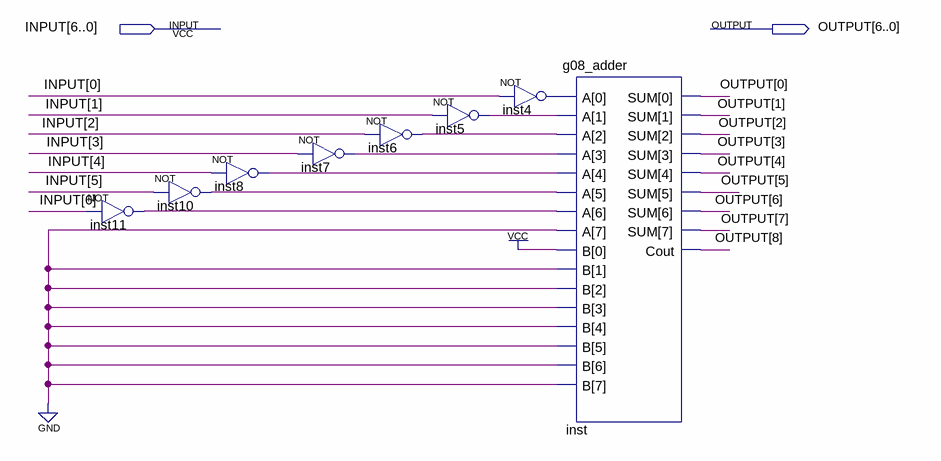
[diagram p0: schematic sheet]
// Quartus schematic 2C7BITS.bdf as structural Verilog: 8 symbols, 2 pins
module \2C7BITS  (
  input  [6:0] INPUT,
  output [8:0] OUTPUT
);

  wire inst4_out, inst5_out, inst6_out, inst7_out, inst8_out, inst10_out, inst11_out;

  not inst11 (inst11_out, INPUT[6]);
  not inst8 (inst8_out, INPUT[4]);
  not inst10 (inst10_out, INPUT[5]);
  not inst7 (inst7_out, INPUT[3]);
  not inst6 (inst6_out, INPUT[2]);
  not inst5 (inst5_out, INPUT[1]);
  not inst4 (inst4_out, INPUT[0]);
  g08_adder inst (
    .A({1'b0, inst11_out, inst10_out, inst8_out, inst7_out, inst6_out, inst5_out, inst4_out}),
    .B(8'b00000001), .SUM(OUTPUT[7:0]), .Cout(OUTPUT[8]));
endmodule
